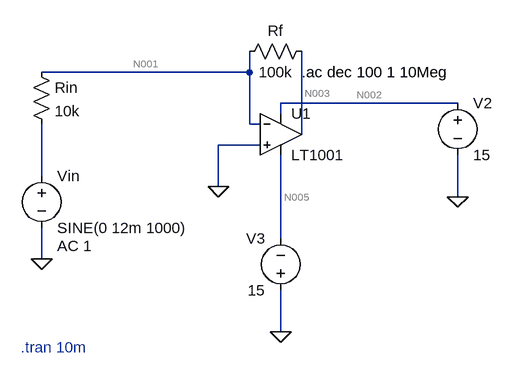
[diagram p0: schematic inverting_amp.asc]
inverting_amp.asc, the LTspice schematic file:
Version 4.1
SHEET 1 880 680
WIRE 208 64 208 32
WIRE 208 64 -112 64
WIRE 528 112 256 112
WIRE 256 128 256 112
WIRE 208 144 208 64
WIRE 224 144 208 144
WIRE 288 160 288 32
WIRE 224 176 160 176
WIRE -112 224 -112 144
WIRE 160 240 160 176
WIRE 528 256 528 192
WIRE 256 320 256 192
WIRE -112 352 -112 304
WIRE 256 464 256 400
FLAG -112 352 0
FLAG 256 464 0
FLAG 528 256 0
FLAG 160 240 0
SYMBOL OpAmps\\LT1001 256 96 R0
SYMATTR InstName U1
SYMBOL voltage -112 208 R0
WINDOW 123 24 124 Left 2
WINDOW 39 0 0 Left 0
SYMATTR Value2 AC 1
SYMATTR InstName Vin
SYMATTR Value SINE(0 12m 1000)
SYMBOL voltage 528 96 R0
WINDOW 123 0 0 Left 0
WINDOW 39 0 0 Left 0
SYMATTR InstName V2
SYMATTR Value 15
SYMBOL voltage 256 416 R180
WINDOW 0 24 96 Left 2
WINDOW 3 24 16 Left 2
WINDOW 123 0 0 Left 0
WINDOW 39 0 0 Left 0
SYMATTR InstName V3
SYMATTR Value 15
SYMBOL res -128 48 R0
SYMATTR InstName Rin
SYMATTR Value 10k
SYMBOL res 304 16 R90
WINDOW 0 0 56 VBottom 2
WINDOW 3 32 56 VTop 2
SYMATTR InstName Rf
SYMATTR Value 100k
TEXT -144 488 Left 2 ;.tran 10m
TEXT 288 64 Left 2 !.ac dec 100 1 10Meg

The netlist it stands for:
* inverting_amp.asc
X§U1 0 N001 N002 N005 N003 LT1001  ; pins In+ In- V+ V- OUT
Vin N004 0 SINE(0 12m 1000) AC 1
V2 N002 0 15
V3 0 N005 15
Rin N001 N004 10k
Rf N003 N001 100k
* .tran 10m
.ac dec 100 1 10Meg
.lib LTC.lib
.backanno
.end

* Results of the author's LTspice run, read from the files saved beside the schematic
* Operating Point, zero values left out:
*   V(n002) = 15 V
*   V(n005) = -15 V
*   I(V2) = -2.25 mA
*   I(V3) = -2.25 mA
*   Ix(u1:3) = 2.25 mA
*   Ix(u1:4) = -2.25 mA
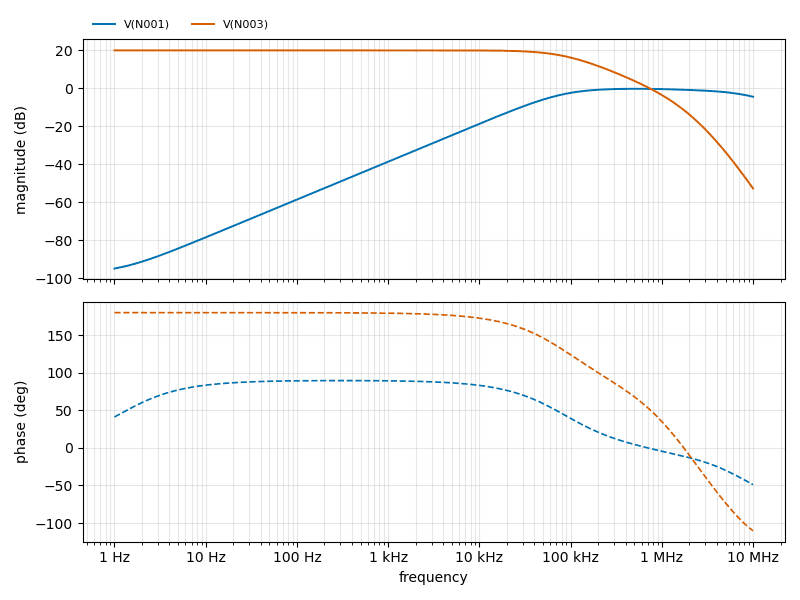
[diagram p1: AC Analysis of inverting_amp.asc, plotted from the saved traces]
* AC Analysis, 1 run:
*   V(N001): -94.99 dB at 1 Hz, -4.46 dB at 10 MHz, peak -0.27 dB at 524.8 kHz, 3 dB below the peak at 80.67 kHz and 7.615 MHz
*   V(N003): 20.00 dB at 1 Hz, -52.81 dB at 10 MHz, peak 20.00 dB at 1 Hz, 3 dB below the peak at 84.56 kHz